# Altium schematic sheet POWERMAN.SchDoc
size A4; SheetNumber: 1; SheetTotal: 4
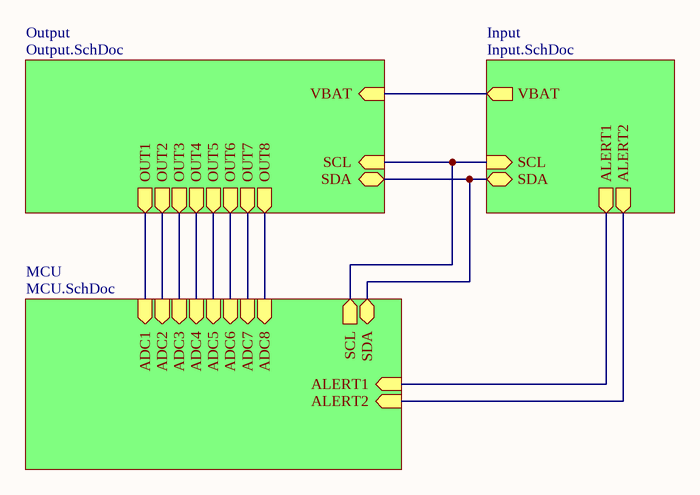
[diagram p0: POWERMAN.SchDoc]

## Sub-sheets
Input = Input.SchDoc: ALERT2 (out), ALERT1 (out), VBAT (out), SDA (bidir), SCL (in)
MCU = MCU.SchDoc: ADC1 (in), ADC2 (in), ADC3 (in), ADC4 (in), ADC5 (in), ADC6 (in), ADC7 (in), ADC8 (in), SCL (out), SDA (bidir), ALERT1 (in), ALERT2 (in)
Output = Output.SchDoc: OUT1 (out), OUT2 (out), OUT3 (out), OUT4 (out), OUT5 (out), OUT6 (out), OUT7 (out), OUT8 (out), SCL (in), SDA (bidir), VBAT (in)

## Nets
(unnamed): sheet MCU/ADC1, sheet Output/OUT1
(unnamed): sheet MCU/ADC2, sheet Output/OUT2
(unnamed): sheet MCU/ADC3, sheet Output/OUT3
(unnamed): sheet MCU/ADC4, sheet Output/OUT4
(unnamed): sheet MCU/ADC5, sheet Output/OUT5
(unnamed): sheet MCU/ADC6, sheet Output/OUT6
(unnamed): sheet MCU/ADC7, sheet Output/OUT7
(unnamed): sheet MCU/ADC8, sheet Output/OUT8
(unnamed): sheet MCU/SCL, sheet Output/SCL, sheet Input/SCL
(unnamed): sheet MCU/SDA, sheet Output/SDA, sheet Input/SDA
(unnamed): sheet MCU/ALERT1, sheet Input/ALERT1
(unnamed): sheet MCU/ALERT2, sheet Input/ALERT2
(unnamed): sheet Output/VBAT, sheet Input/VBAT